# EasyEDA schematic WaterTank.json

## Sheets
1 Main: TITLE: Sheet_1; REV: 1.0; Date: 2021-06-01; Sheet: 1/1; Company: Your Company
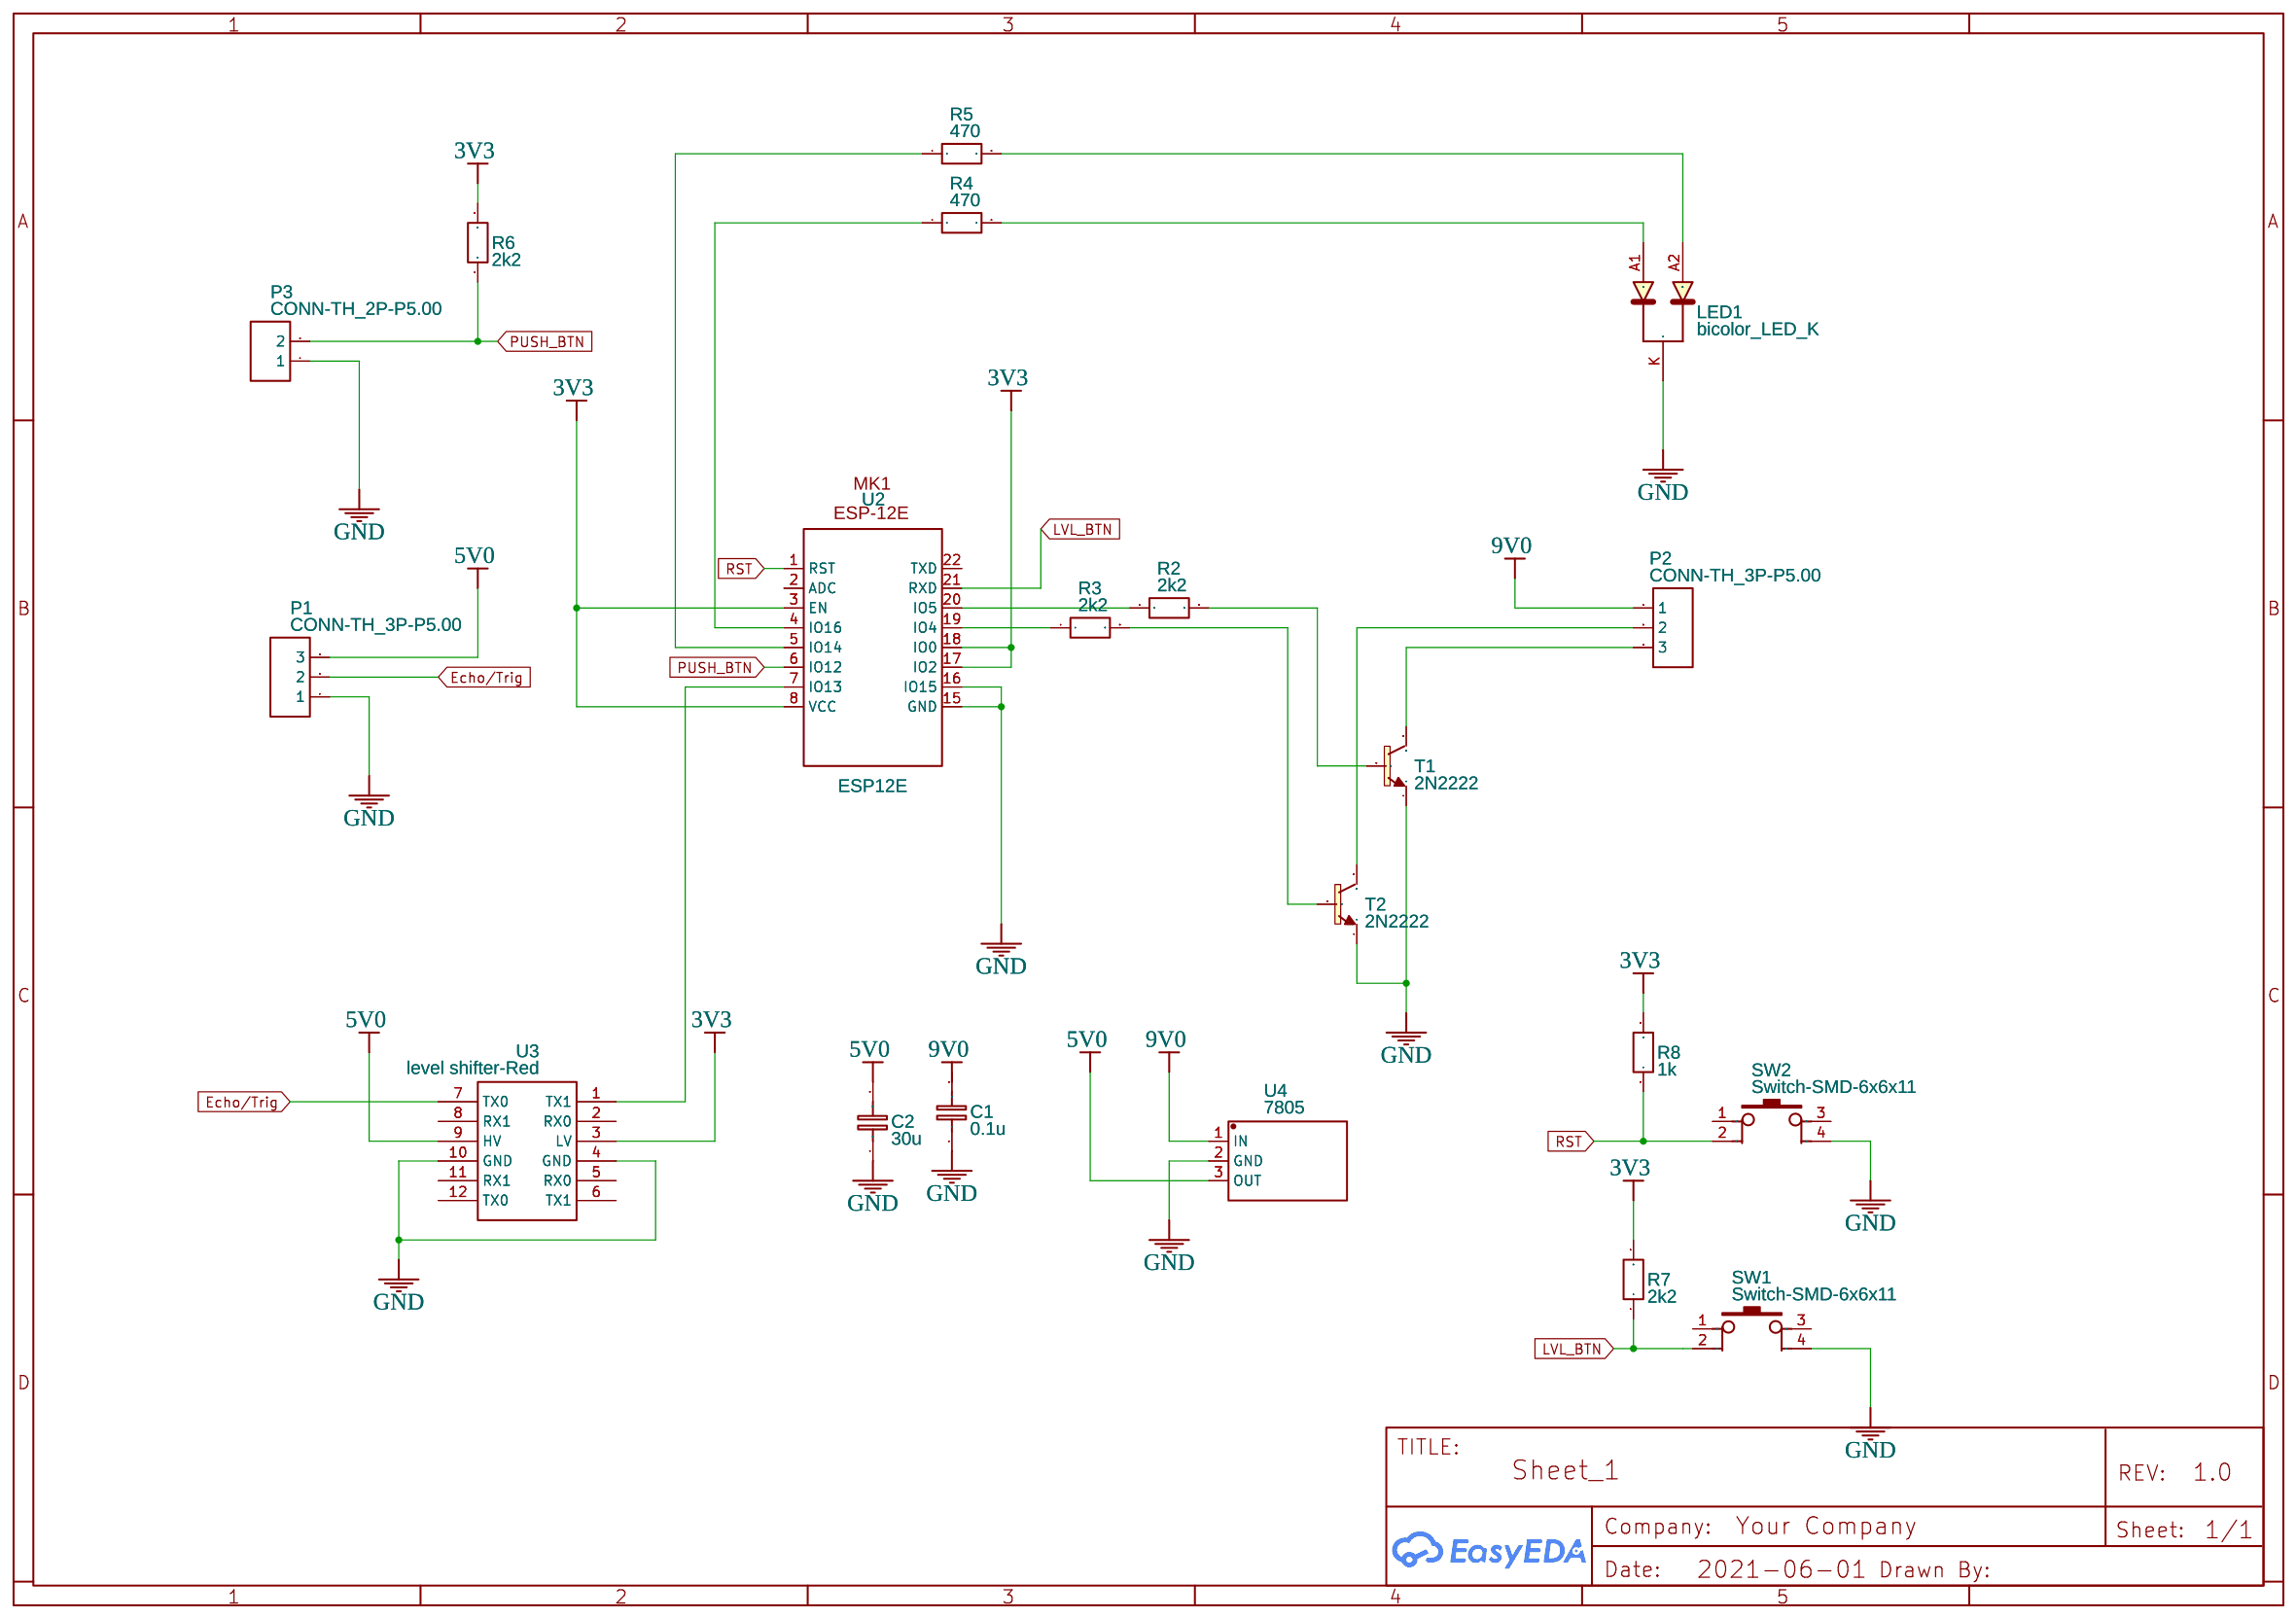
[diagram p0: Main]
2 Water Level Sensor: Date: 2021-06-02; Drawn By: DKnight110
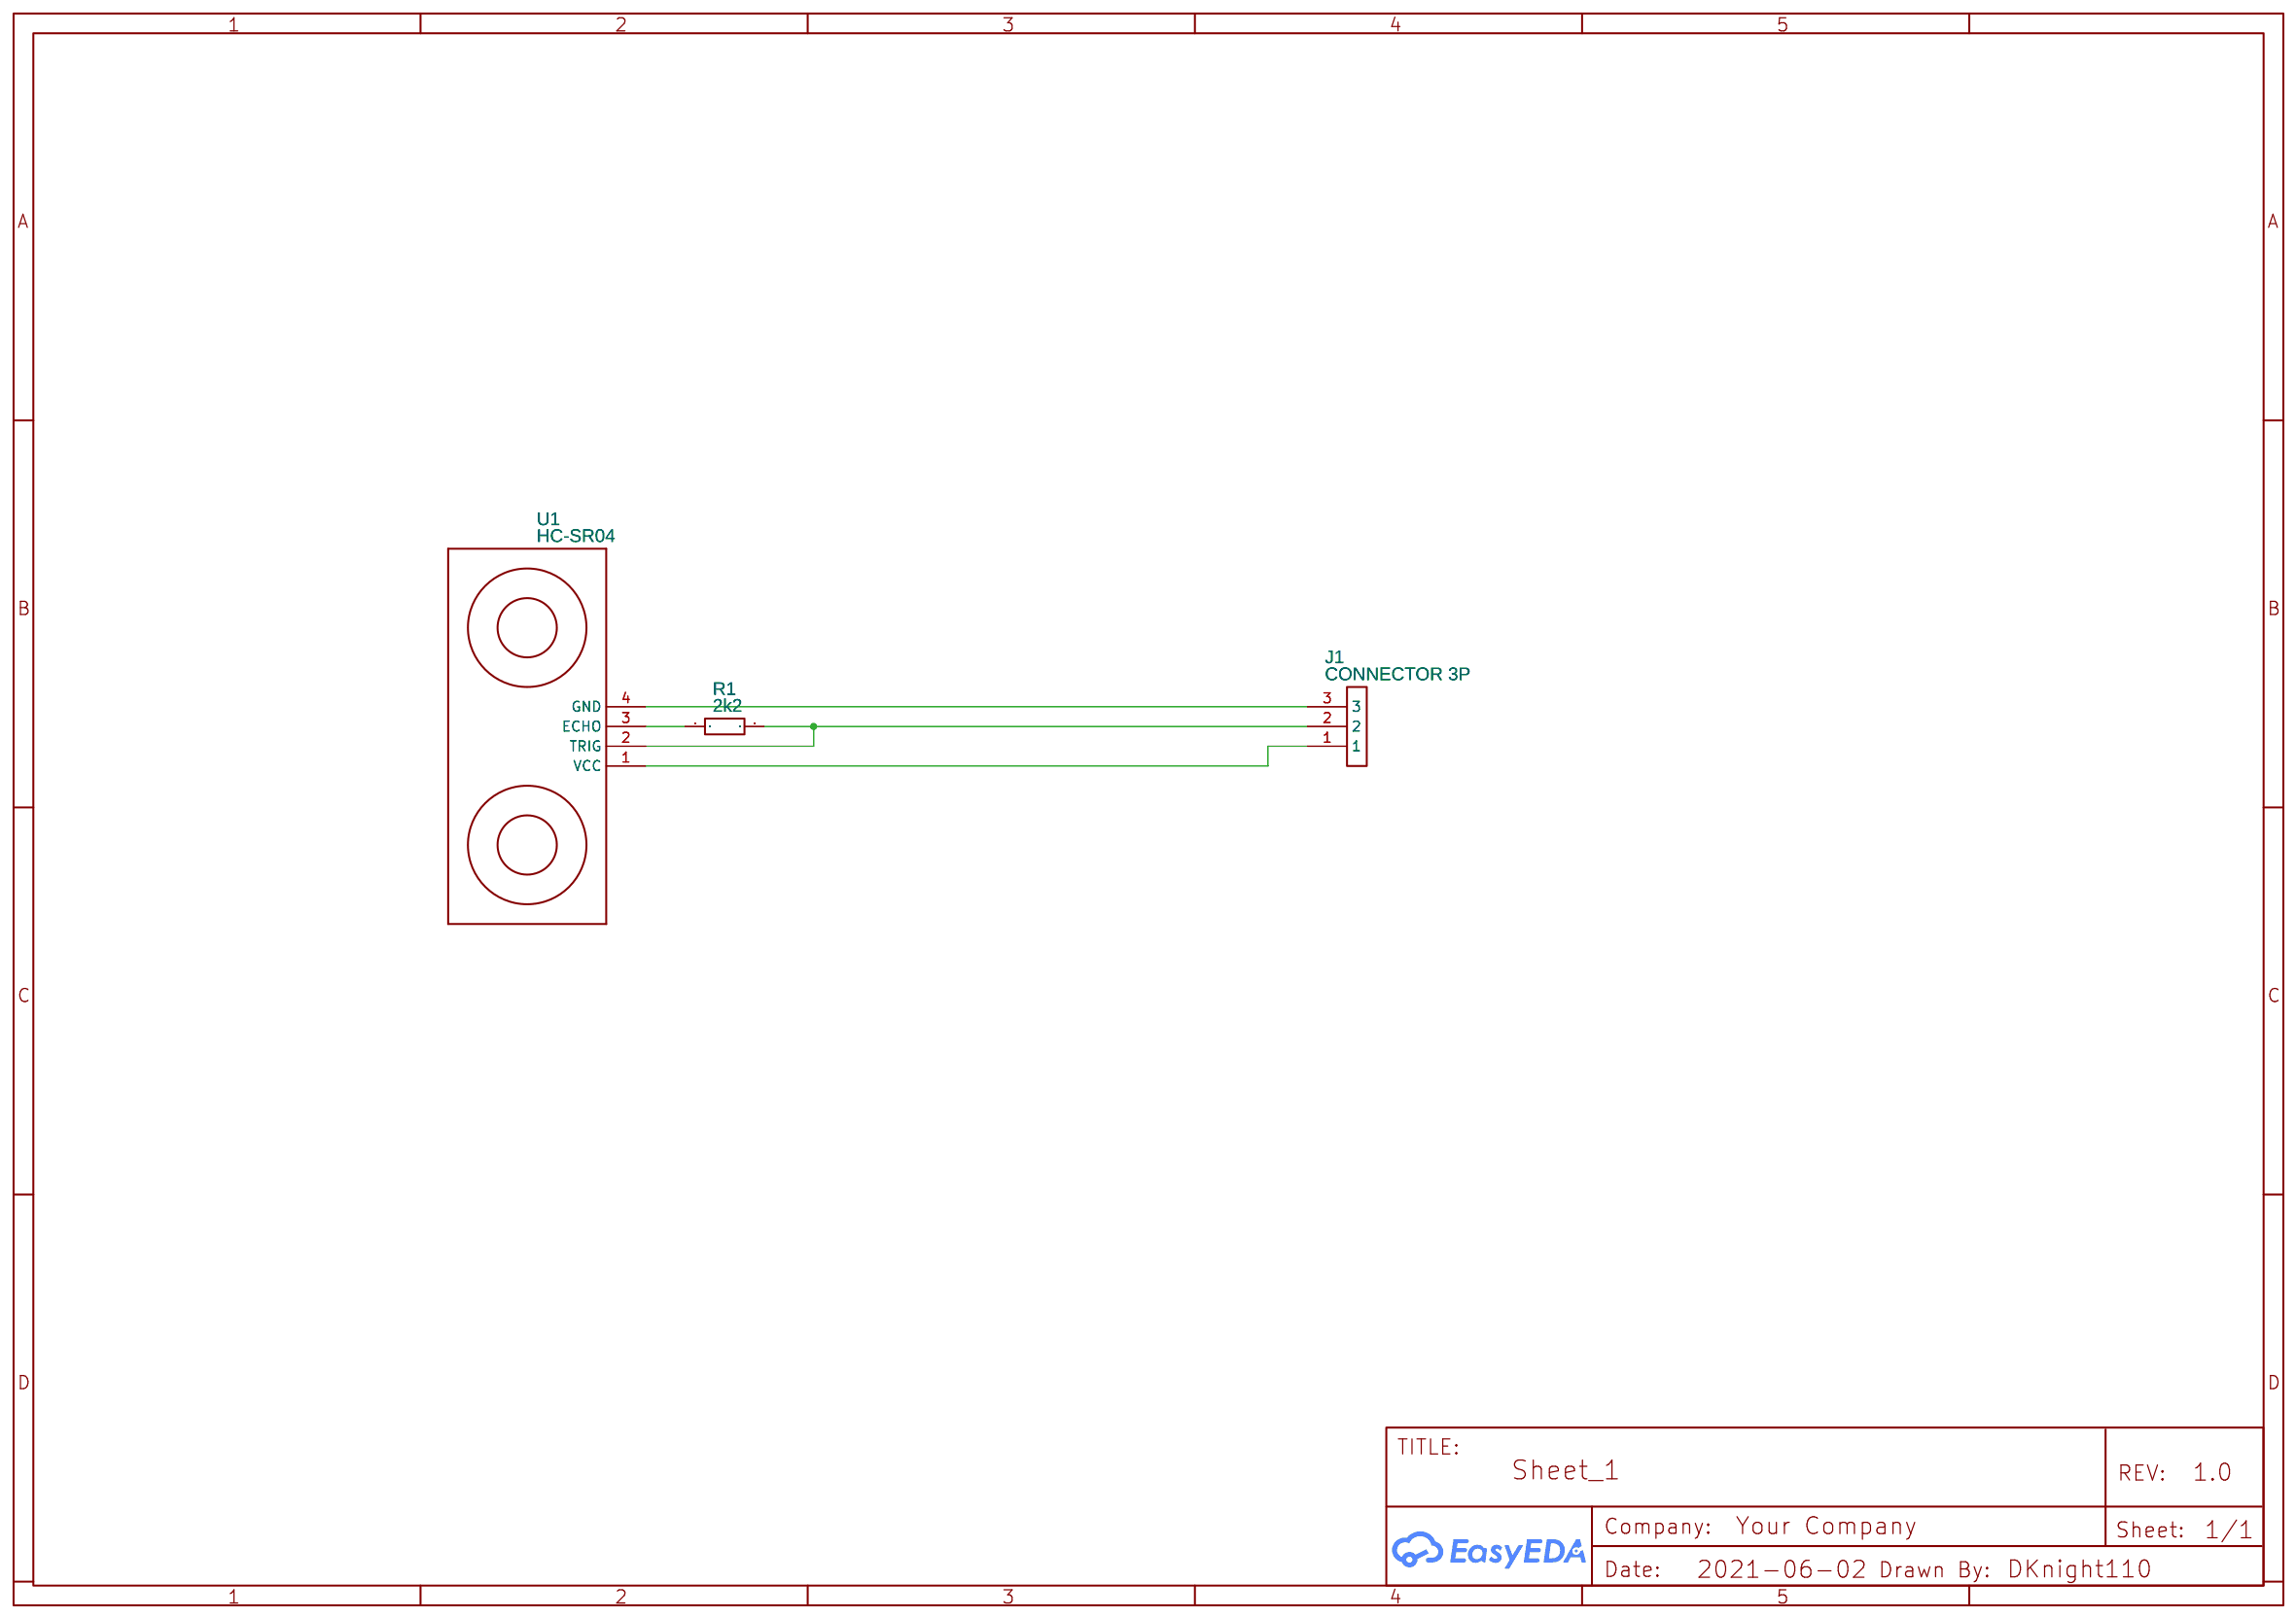
[diagram p1: Water Level Sensor]

## Parts
sheet Main
C1  0.1u  [C0603]
C2  30u  [C0603]
LED1  bicolor_LED_K  [BICOLOR LED 3MM]
P1  CONN-TH_3P-P5.00  [CONN-TH_3P-P5.00]
P2  CONN-TH_3P-P5.00  [CONN-TH_3P-P5.00]
P3  CONN-TH_2P-P5.00  [CONN-TH_2P-P5.00]
R2  2k2  [R0603]
R3  2k2  [R0603]
R4  470  [R0603]
R5  470  [R0603]
R6  2k2  [R0603]
R7  2k2  [R0603]
R8  1k  [R0603]
SW1  Switch-SMD-6x6x11  [SW-SMD_4P-L6.0-W6.0-P4.50-LS8.5]
SW2  Switch-SMD-6x6x11  [SW-SMD_4P-L6.0-W6.0-P4.50-LS8.5]
T1  2N2222  [TO92-EBC-OVAL]
T2  2N2222  [TO92-EBC-OVAL]
U2  ESP12E  [ESP12E]
U3  level shifter-Red  [IIC LOGIC LEVEL CONVERTER]
U4  7805  [TO-220-3_L10.0-W4.5-P2.54-L]
sheet Water Level Sensor
J1  CONNECTOR 3P  [JST-XH 3P]
R1  2k2  [AXIAL-0.5]
U1  HC-SR04  [HC-SR04]

## Library data of the parts
C1 C2 = C_0603_EU: Contributor: LCEDA_Lib
LED1 = bicolor_LED_K: Manufacturer Part: bicolor LED; link: http://www.ashopbd.com/wp-content/uploads/2016/05/led_5mm_bicolor.jpg; Contributor: stentz
P1 P2 = CONN-TH_3P-P5.00: Supplier: LCSC; Contributor: LCEDA_Lib
P3 = CONN-TH_2P-P5.00: Supplier: LCSC; Contributor: LCEDA_Lib
R2-R8 = R_0603_EU: Contributor: LCEDA_Lib
SW1 SW2 = Switch-SMD-6x6x11: Supplier Part: C91998; Supplier: LCSC; Manufacturer: BBJ; Manufacturer Part: Switch6*6*11
T1 T2 = 2N2222: Contributor: Faqih R Miftah
U2 = ESP12E: Contributor: deepak.engg84
U3 = level shifter-Red: Manufacturer Part: level shifter; Contributor: jongjejung
U4 = 7805: Supplier: LCSC; Supplier Part: C305416; Manufacturer: Foshan Blue Rocket Elec; Contributor: LCSC; JLCPCB Part Class: Extended Part
J1 = CONNECTOR 3P: Contributor: wayneosdias
R1 = 2k2: Power: 1/2W; Tolerance: ±5%; EasyEDA: C69874; Supplier Part: C69874; Supplier: EasyEDA; Manufacturer Part: CFR02SJ0220A10
U1 = HC-SR04: Ultrasonic Ranging Module HC-SR04; Contributor: h6000p

## Nets
3V3: R6.2 R7.2 R8.2 U2.3(EN) U2.8(VCC) U2.17(IO2) U2.18(IO0) U3.3(LV)
5V0: C2.2 P1.3 U3.9(HV) U4.3(OUT)
9V0: P2.1 U4.1(IN)
GND: C1.1 C2.1 LED1.K P1.1 P3.1 SW1.4 SW2.4 T1.E T2.E U2.15(GND) U2.16(IO15) U3.4(GND) U3.10(GND) U4.2(GND)
Echo/Trig: P1.2 U3.7(TX0)
LVL_BTN: R7.1 SW1.2 U2.21(RXD)
PUSH_BTN: P3.2 R6.1 U2.6(IO12)
RST: R8.1 SW2.2 U2.1(RST)
Net-(J1-1): J1.1 U1.1(VCC)
Net-(J1-2): J1.2 R1.2 U1.2(TRIG)
Net-(J1-3): J1.3 U1.4(GND)
Net-(LED1-A1): LED1.A1 R4.2
Net-(LED1-A2): LED1.A2 R5.2
Net-(P2-2): P2.2 T2.C
Net-(P2-3): P2.3 T1.C
Net-(R1-1): R1.1 U1.3(ECHO)
Net-(R2-1): R2.1 U2.20(IO5)
Net-(R2-2): R2.2 T1.B
Net-(R3-1): R3.1 U2.19(IO4)
Net-(R3-2): R3.2 T2.B
Net-(R4-1): R4.1 U2.4(IO16)
Net-(R5-1): R5.1 U2.5(IO14)
Net-(U2-7): U2.7(IO13) U3.1(TX1)

Not connected (* = marked no-connect by the designer): C1 2; SW1 1 3; SW2 1 3; U2 2(ADC) 22(TXD); U3 2(RX0) 5(RX0) 6(TX1) 8(RX1) 11(RX1) 12(TX0)
